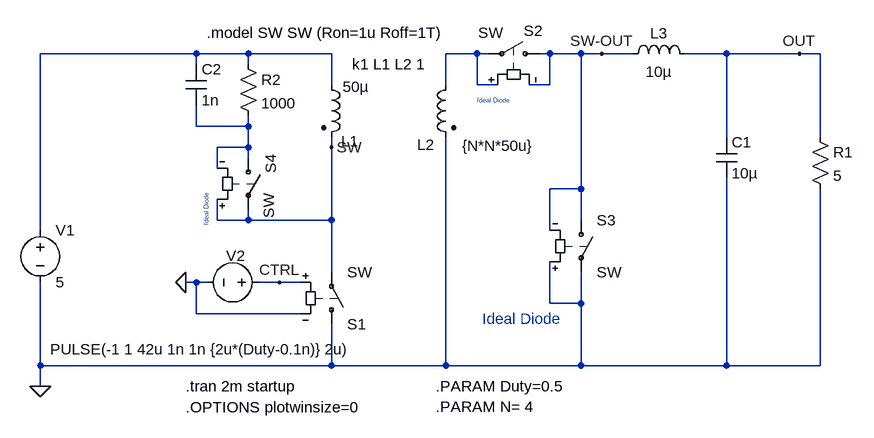
[diagram p0: schematic Fig_7-39_Forward_Ideal_50.asc]
Fig_7-39_Forward_Ideal_50.asc, the LTspice schematic file:
Version 4
SHEET 1 880 680
WIRE -912 -656 -1152 -656
WIRE -832 -656 -912 -656
WIRE -704 -656 -832 -656
WIRE -480 -656 -528 -656
WIRE -464 -656 -480 -656
WIRE -368 -656 -384 -656
WIRE -320 -656 -368 -656
WIRE -288 -656 -320 -656
WIRE -240 -656 -288 -656
WIRE -96 -656 -160 -656
WIRE 16 -656 -96 -656
WIRE 48 -656 16 -656
WIRE -912 -640 -912 -656
WIRE -832 -640 -832 -656
WIRE -704 -608 -704 -656
WIRE -528 -608 -528 -656
WIRE -480 -608 -480 -656
WIRE -448 -608 -480 -608
WIRE -368 -608 -368 -656
WIRE -368 -608 -400 -608
WIRE -912 -544 -912 -576
WIRE -832 -544 -832 -560
WIRE -832 -544 -912 -544
WIRE -96 -528 -96 -656
WIRE 48 -528 48 -656
WIRE -832 -512 -832 -544
WIRE -832 -512 -880 -512
WIRE -704 -512 -704 -528
WIRE -832 -496 -832 -512
WIRE -880 -480 -880 -512
WIRE -320 -448 -320 -656
WIRE -320 -448 -368 -448
WIRE -880 -400 -880 -432
WIRE -832 -400 -832 -416
WIRE -832 -400 -880 -400
WIRE -704 -400 -704 -512
WIRE -704 -400 -832 -400
WIRE -320 -400 -320 -448
WIRE -1152 -384 -1152 -656
WIRE -368 -384 -368 -448
WIRE -704 -320 -704 -400
WIRE -912 -304 -928 -304
WIRE -896 -304 -912 -304
WIRE -784 -304 -816 -304
WIRE -752 -304 -784 -304
WIRE -368 -272 -368 -336
WIRE -320 -272 -320 -320
WIRE -320 -272 -368 -272
WIRE -912 -256 -912 -304
WIRE -752 -256 -912 -256
WIRE -1152 -176 -1152 -304
WIRE -704 -176 -704 -240
WIRE -704 -176 -1152 -176
WIRE -528 -176 -528 -528
WIRE -528 -176 -704 -176
WIRE -320 -176 -320 -272
WIRE -320 -176 -528 -176
WIRE -96 -176 -96 -464
WIRE -96 -176 -320 -176
WIRE 48 -176 48 -448
WIRE 48 -176 -96 -176
WIRE -1152 -144 -1152 -176
FLAG -784 -304 CTRL
FLAG -1152 -144 0
FLAG 16 -656 OUT
FLAG -928 -304 0
FLAG -288 -656 SW-OUT
FLAG -704 -512 SW
SYMBOL sw -704 -224 M180
SYMATTR InstName S1
SYMBOL ind2 -720 -624 R0
WINDOW 0 31 103 Left 2
WINDOW 3 33 19 Left 2
WINDOW 39 36 12 Left 2
SYMATTR InstName L1
SYMATTR Value 50µ
SYMATTR Type ind
SYMBOL cap -112 -528 R0
SYMATTR InstName C1
SYMATTR Value 10µ
SYMBOL voltage -1152 -400 R0
SYMATTR InstName V1
SYMATTR Value 5
SYMBOL voltage -800 -304 R90
WINDOW 123 0 0 Left 2
WINDOW 39 0 0 Left 2
WINDOW 0 -41 37 VRight 2
WINDOW 3 103 -129 VRight 2
SYMATTR InstName V2
SYMATTR Value PULSE(-1 1 42u 1n 1n {2u*(Duty-0.1n)} 2u)
SYMBOL res 32 -544 R0
SYMATTR InstName R1
SYMATTR Value 5
SYMBOL ind2 -512 -624 M0
WINDOW 0 33 108 Left 2
WINDOW 3 -119 110 Left 2
WINDOW 39 18 -32 Left 2
SYMATTR InstName L2
SYMATTR Value {N*N*50u}
SYMATTR Type ind
SYMBOL sw -368 -656 M270
WINDOW 0 35 40 VLeft 2
WINDOW 3 32 110 VLeft 2
SYMATTR InstName S2
SYMBOL ind -256 -640 R270
WINDOW 0 32 56 VTop 2
WINDOW 3 4 56 VBottom 2
SYMATTR InstName L3
SYMATTR Value 10µ
SYMBOL sw -320 -416 R0
SYMATTR InstName S3
SYMBOL res -848 -656 R0
SYMATTR InstName R2
SYMATTR Value 1000
SYMBOL cap -928 -640 R0
SYMATTR InstName C2
SYMATTR Value 1n
SYMBOL sw -832 -512 R0
WINDOW 0 35 40 VLeft 2
WINDOW 3 32 110 VLeft 2
SYMATTR InstName S4
TEXT -896 -688 Left 2 !.model SW SW (Ron=1u Roff=1T)
TEXT -928 -144 Left 2 !.tran 2m startup
TEXT -672 -640 Left 2 !k1 L1 L2 1
TEXT -480 -584 Left 0 ;Ideal Diode
TEXT -472 -248 Left 2 ;Ideal Diode
TEXT -928 -112 Left 2 !.OPTIONS plotwinsize=0
TEXT -896 -392 VLeft 0 ;Ideal Diode
TEXT -544 -144 Left 2 !.PARAM Duty=0.5\n.PARAM N= 4

The netlist it stands for:
* Fig_7-39_Forward_Ideal_50.asc
S1 0 SW CTRL 0 SW
L1 N001 SW 50µ
C1 OUT 0 10µ
V1 N001 0 5
V2 CTRL 0 PULSE(-1 1 42u 1n 1n {2u*(Duty-0.1n)} 2u)
R1 OUT 0 5
L2 N002 0 {N*N*50u}
S2 SW-OUT N002 N002 SW-OUT SW
L3 SW-OUT OUT 10µ
S3 SW-OUT 0 0 SW-OUT SW
R2 N001 N003 1000
C2 N001 N003 1n
S4 N003 SW SW N003 SW
.model SW SW (Ron=1u Roff=1T)
.tran 2m startup
k1 L1 L2 1
* Ideal Diode
* Ideal Diode
.OPTIONS plotwinsize=0
* Ideal Diode
.PARAM Duty=0.5
.PARAM N= 4
.backanno
.end